# EAGLE design WhiteCane (EAGLE 7.4.0)
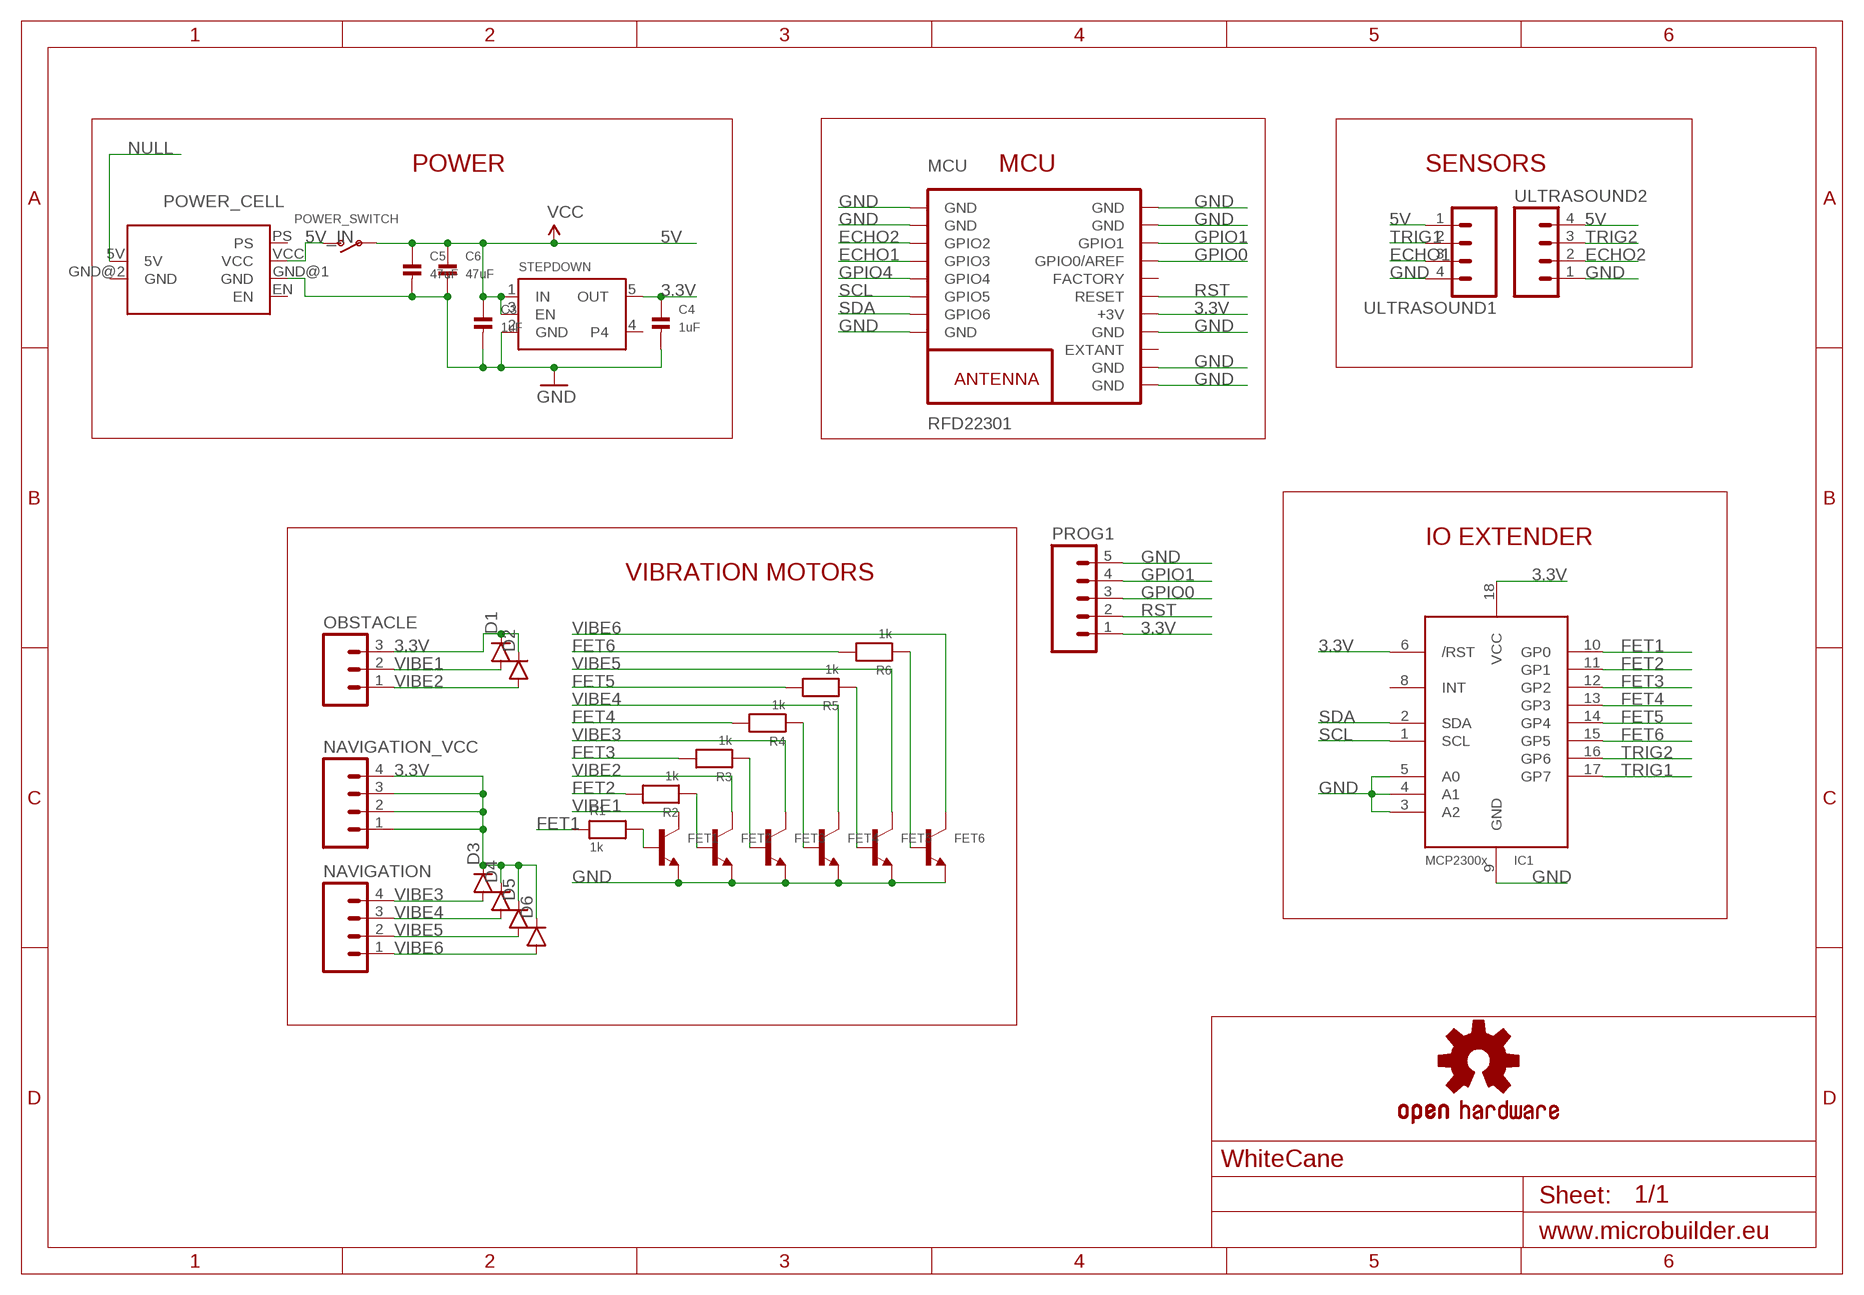
[diagram p0: schematic, sheet 1]

## Parts
C3  1uF  CAP_CERAMIC0603  [0603]
C4  1uF  CAP_CERAMIC0603  [0603]
C5  47uF  CAP_CERAMIC0805  [0805]
C6  47uF  CAP_CERAMIC0805  [0805]
D1  DIODESOD123  [SOD-123]
D2  DIODESOD123  [SOD-123]
D3  DIODESOD123  [SOD-123]
D4  DIODESOD123  [SOD-123]
D5  DIODESOD123  [SOD-123]
D6  DIODESOD123  [SOD-123]
FET1  TRANSISTOR_NPN  [SOT23-R]
FET2  TRANSISTOR_NPN  [SOT23-R]
FET3  TRANSISTOR_NPN  [SOT23-R]
FET4  TRANSISTOR_NPN  [SOT23-R]
FET5  TRANSISTOR_NPN  [SOT23-R]
FET6  TRANSISTOR_NPN  [SOT23-R]
IC1  MCP23008/SO  [SO18W]
LOGO1  OSHW-LOGOL-COPPER  [OSHW-LOGO-L_COPPER]
MCU  RFD22301  [RFD22301]
NAVIGATION  M04PTH  [1X04]
NAVIGATION_VCC  M04PTH  [1X04]
OBSTACLE  M03PTH  [1X03]
POWER_CELL  POWER_CELL  [POWER_CELL]
POWER_SWITCH  SWITCH_SPST  [SPST_SMT_19192]
PROG1  M05PTH  [1X05]
R1  1k  RESISTOR0603  [0603]
R2  1k  RESISTOR0603  [0603]
R3  1k  RESISTOR0603  [0603]
R4  1k  RESISTOR0603  [0603]
R5  1k  RESISTOR0603  [0603]
R6  1k  RESISTOR0603  [0603]
STEPDOWN  VREG_SOT23-5  [SOT23-5]
ULTRASOUND1  M04PTH  [1X04]
ULTRASOUND2  M04PTH  [1X04]

## Nets
3.3V: C4.1 D1.C D2.C D3.C D4.C D5.C D6.C IC1.6(/RST) IC1.18(VCC) MCU.13(+3V) NAVIGATION_VCC.1 NAVIGATION_VCC.2 NAVIGATION_VCC.3 NAVIGATION_VCC.4 OBSTACLE.3 PROG1.1 STEPDOWN.5(OUT)
5V: C3.1 C5.1 C6.1 POWER_SWITCH.B(P) STEPDOWN.1(IN) STEPDOWN.3(EN) ULTRASOUND1.1 ULTRASOUND2.4 ; supply symbol labelled VCC
5V_IN: POWER_CELL.VCC POWER_SWITCH.C(S)
ECHO1: MCU.4(GPIO3) ULTRASOUND1.3
ECHO2: MCU.3(GPIO2) ULTRASOUND2.2
FET1: IC1.10(GP0) R1.1
FET2: IC1.11(GP1) R2.2
FET3: IC1.12(GP2) R3.2
FET4: IC1.13(GP3) R4.2
FET5: IC1.14(GP4) R5.2
FET6: IC1.15(GP5) R6.2
GND: C3.2 C4.2 C5.2 C6.2 FET1.2(E) FET2.2(E) FET3.2(E) FET4.2(E) FET5.2(E) FET6.2(E) IC1.3(A2) IC1.4(A1) IC1.5(A0) IC1.9(GND) MCU.1(GND) MCU.2(GND) MCU.8(GND) MCU.9(GND) MCU.10(GND) MCU.12(GND) MCU.18(GND) MCU.19(GND) POWER_CELL.GND@1(GND) PROG1.5 STEPDOWN.2(GND) ULTRASOUND1.4 ULTRASOUND2.1
GPIO0: MCU.16(GPIO0/AREF) PROG1.3
GPIO1: MCU.17(GPIO1) PROG1.4
GPIO4: MCU.5(GPIO4)
N$1: FET1.1(B) R1.2
N$2: FET2.1(B) R2.1
N$3: FET3.1(B) R3.1
N$4: FET4.1(B) R4.1
N$5: FET5.1(B) R5.1
N$6: FET6.1(B) R6.1
NULL: POWER_CELL.5V
RST: MCU.14(RESET) PROG1.2
SCL: IC1.1(SCL) MCU.6(GPIO5)
SDA: IC1.2(SDA) MCU.7(GPIO6)
TRIG1: IC1.17(GP7) ULTRASOUND1.2
TRIG2: IC1.16(GP6) ULTRASOUND2.3
VIBE1: D1.A FET1.3(C) OBSTACLE.2
VIBE2: D2.A FET2.3(C) OBSTACLE.1
VIBE3: D3.A FET3.3(C) NAVIGATION.4
VIBE4: D4.A FET4.3(C) NAVIGATION.3
VIBE5: D5.A FET5.3(C) NAVIGATION.2
VIBE6: D6.A FET6.3(C) NAVIGATION.1
Unconnected: IC1.8(INT) MCU.11(EXTANT) MCU.15(FACTORY) POWER_CELL.EN POWER_CELL.PS STEPDOWN.4

## Notes on the sheet
- POWER | MCU | SENSORS
- IO EXTENDER
- VIBRATION MOTORS

## Power pins joined to a net without a drawn wire
GND: POWER_CELL.GND@2(GND)

## Library data of the parts
C3-C6 = microbuilder:CAP_CERAMIC: Ceramic Capacitors 0402 - 0402 Surface Mount Capacitors 16pF 50V 5% [Digikey: 445-4899-2-ND] 18pF 50V 5% [Digikey: 490-1281-2-ND] 22pF 50V 5% [Digikey: 490-1283-2-ND] 68pF 50V 5% [Digikey: 490-1289-2-ND] 0.1uF 10V 10% [Digikey: 490-1318-2-ND] 1.0uF 6.3V 10% [Digikey: 490-1320-2-ND] 0603 - 0603 Surface Mount Capacitors 16 pF 50V 5% [Digikey: 445-5051-2-ND] 22 pF 50V [Digikey: PCC220ACVTR-ND] 33 pF 50V 5% [Digikey: 490-1415-1-ND] 56pF 50V 5% [Digikey: 490-1421-1-ND] 220pF 50V 5% [Digikey: 445-1285-1-ND] 680 pF 50V 2200 pF 50V 5% C0G [Digikey: 445-1297-1-ND] 5600 pF 100V 5% X7R [Digikey: 478-3711-1-ND] 0.1 µF 25V 10% [Digikey: PCC2277TR-ND] 0.22 µF 16V 10% X7R [Digikey: 445-1318-1-ND] 1.0 µF 25V 10% [Digikey: 445-5146-2-ND] 0603 - RF Specific 3pF 250V +/-0.1pF RF [Digikey: 712-1347-1-ND] 18 pF 250V 5% [Digikey: 478-3505-1-ND or 712-1322-1-ND] 56 pF 250V 5% C0G RF [Digikey: 490-4867-1-ND] 68 pF 250V RF [Digikey: 490-4868-1-ND] 0805 - 0805 Surface Mount Capacitors 220 pF 250V 2% RF Ceramic Capacitor [Digikey: 712-1398-1-ND] 1000 pF 50V 2% NP0 Ceramic Capacitor [Digikey: 478-3760-1-ND] 0.1 µF 25V 10% Ceramic Capacitor [Digikey: PCC1828TR-ND] 1.0 µF 16V 10% Ceramic Capacitor[Digikey: 490-1691-2-ND] 10.0 µF 10V 10% Ceramic Capacitor[Digikey: 709-1228-1-ND] 10.0 uF 16V 10% Ceramic Capacitor [Digikey: 478-5165-2-ND] 47 uF 6.3V 20% Ceramic Capacitor [Digikey: 587-1779-1-ND or 399-5506-1-ND] 1206 - 1206 Surface Mount Capacitors 47uF 10V 20% Ceramic Capacitor [Digikey: 490-5528-1-ND or 399-5508-1-ND or 445-6010-1-ND] 100uF 6.3V -20%, +80% Y5V Ceramic Capacitor (Digikey: 490-4512-1-ND, Mouser: 81-GRM31CF50J107ZE1L)
D1-D6 = SparkFun-DiscreteSemi:DIODE: Diode These are standard reverse protection diodes and small signal diodes. SMA package can handle up to about 1A. SOD-323 can handle about 200mA. What the SOD-323 package when ordering, there are some mfgs out there that are 5-pin packages.
FET1-FET6 = microbuilder:TRANSISTOR_NPN: NPN Transistor Transistor (NPN) 500mA 45V - BC817 [Digikey: 568-1631-1-ND] Transistor (NPN) 500mA 45V - BC817,215 [Mouser: 771-BC817-T/R] SOT23-R - SOT23 footprint optimised for use with solder paste and reflow ovens. SOT23-W - SOT23 footprint optimised for hand-soldering (larger pads).
IC1 = adafruit:MCP23008: MCP23008 Inexpensive i2c i/o expander - 8 general purpose i/o pins with optional pullups
LOGO1 = SparkFun-Aesthetics:OSHW-LOGO: Open Source Hardware Logo This logo indicates the piece of hardware it is found on incorporates a OSHW license and/or adheres to the definition of open source hardware found here: http://freedomdefined.org/OSHW
MCU = RF_Digital_RFD22301_Eagle_Schematic_PCB_Library:RFD22301: RFD22301 RFduino SMT Module RFD22301 Datasheet: http://www.rfdigital.com/wp-content/uploads/2014/03/RFD22301.Data_.Sheet_.11.24.13_11.38PM.pdf
NAVIGATION NAVIGATION_VCC ULTRASOUND1 ULTRASOUND2 = SparkFun-Connectors:M04: Header 4 Standard 4-pin 0.1" header. Use with straight break away headers (SKU : PRT-00116), right angle break away headers (PRT-00553), swiss pins (PRT-00743), machine pins (PRT-00117), and female headers (PRT-00115). Molex polarized connector foot print use with SKU : PRT-08231 with associated crimp pins and housings. 1MM SMD Version SKU: PRT-10208
OBSTACLE = SparkFun-Connectors:M03: Header 3 Standard 3-pin 0.1" header. Use with straight break away headers (SKU : PRT-00116), right angle break away headers (PRT-00553), swiss pins (PRT-00743), machine pins (PRT-00117), and female headers (PRT-00115). Molex polarized connector foot print use with SKU : PRT-08232 with associated crimp pins and housings.
POWER_CELL = myParts:POWER_CELL
POWER_SWITCH = microbuilder:SWITCH_SPST: Switch - SPST 4UCon 19192 (6.7x2.6mm SMT)
PROG1 = SparkFun-Connectors:M05: Header 5 Standard 5-pin 0.1" header. Use with straight break away headers (SKU : PRT-00116), right angle break away headers (PRT-00553), swiss pins (PRT-00743), machine pins (PRT-00117), and female headers (PRT-00115). Molex polarized connector foot print use with SKU : PRT-08230 with associated crimp pins and housings.
R1-R6 = microbuilder:RESISTOR: Resistors 0402 - 0402 Surface Mount Package 22 Ohm 1% 1/16W [Digikey: 311-22.0LRTR-ND] 33 Ohm 5% 1/16W 1.0K 5% 1/16W 1.5K 5% 1/16W 2.0K 1% 1/16W 10.0K 1% 1/16W [Digikey: 311-10.0KLRTR-ND] 10.0K 5% 1/16W [Digikey: RMCF0402JT10K0TR-ND] 12.1K 1% 1/16W [Digikey: 311-22.0LRTR-ND] 100.0K 5% 1/16W 0603 - 0603 Surface Mount Package 0 Ohm 1/10 Watt 1% Resistor 15 Ohm 1/10 Watt 1% Resistor 33 Ohm 1/10 Watt 1% Resistor 49.9 Ohm 1/10 Watt 1% Resistor 100 Ohm 1/10 Watt 1% Resistor 150 Ohm 1/10 Watt 1% Resistor 240 Ohm 1/10 Watt 1% Resistor 390 Ohm 1/10 Watt 1% Resistor 560 Ohm 1/10 Watt 1% Resistor 680 Ohm 1/10 Watt 1% Resistor 750 Ohm 1/10 Watt 1% Resistor 1.0K Ohm 1/10 Watt 1% Resistor 1.5K Ohm 1/10 Watt 1% Resistor 2.0K Ohm 1/10 Watt 1% Resistor 2.2K Ohm 1/10 Watt 1% Resistor 3.3K Ohm 1/10 Watt 1% Resistor 4.7K Ohm 1/10 Watt 1% Resistor 10.0K Ohm 1/10 Watt 1% Resistor 12.0K Ohm 1/10 Watt 1% Resistor 12.1K Ohm 1/10 Watt 1% Resistor 20.0K Ohm 1/10 Watt 1% Resistor 33.0K Ohm 1/10 Watt 1% Resistor 100.0K Ohm 1/10 Watt 1% Resistor 0805 - 0805 Surface Mount Package 0 Ohm 1/8 Watt 1% Resistor 33 Ohm 1/8 Watt 1% Resistor 100 Ohm 1/8 Watt 1% Resistor 150 Ohm 1/8 Watt 1% Resistor 200 Ohm 1/8 Watt 1% Resistor 240 Ohm 1/8 Watt 1% Resistor 330 Ohm 1/8 Watt 1% Resistor 390 Ohm 1/8 Watt 1% Resistor 470 Ohm 1/8 Watt 1% Resistor 1.0K Ohm 1/8 Watt 1% Resistor 1.5K Ohm 1/8 Watt 1% Resistor 2.0K Ohm 1/8 Watt 1% Resistor 4.7K Ohm 1/8 Watt 1% Resistor 5.1K Ohm 1/8 Watt 1% Resistor 5.6K Ohm 1/8 Watt 1% Resistor 10.0K Ohm 1/8 Watt 1% Resistor 22.0K Ohm 1/8 Watt 1% Resistor 33.0K Ohm 1/8 Watt 1% Resistor 100K Ohm 1/8 Watt 1% Resistor 1206 - 1206 Surface Mount Package 2012 - 2010 Surface Mount Package 0.11 Ohm 1/2 Watt 1% Resistor - Digikey: RHM.11UCT-ND
STEPDOWN = microbuilder:VREG_SOT23-5: SOT23-5 Fixed Voltage Regulators To better organise some of the SOT23-5 fixed voltage regulators in this library, this new part was created. Part Current Out V Out V In V Dropout Digikey Part No. ADP121 150mA 3.3V 3.4-5.5V 0.09V @ 150mA ADP121-AUJZ33R7CT-ND ADP121 150mA 3.0V 3.1-5.5V 0.09V @ 150mA ADP121-AUJZ30R7CT-ND ADP122 300mA 3.3V 3.4-5.5V 0.085V @ 300mA ADP122AUJZ-3.3-R7CT-ND ADP1712 300mA 3.3V 3.5-5.5V 0.17V @ 300mA ADP1712AUJZ-3.3-R7TR-ND AP7311 (Low Cost) 150mA 3.3V 3.5-6V 0.15V @ 150mA AP7311-33WG-7DICT-ND LD39015M18R 150mA 1.8V 1.9V-5.5V 0.08V @ 100mA 497-6977-1-ND MCP1824T-3302E/OT 300mA 3.3V 3.5V-6V 0.2V @ 300mA MCP1824T-3302E/OTCT-ND MIC5205-2.5YM5 TR 150mA 2.5V 2.7-16V 0.165V @ 150mA 576-1257-2-ND MIC5205-3.0YM5 TR 150mA 3.0V 3.2V-16V 0.165V @ 150mA 576-1258-2-ND MIC5205-3.3YM5 TR 150mA 3.3V 3.5V-16V 0.165V @ 150mA 576-1259-2-ND TPS780330220 150mA 3.3V+2.2V 3.6-5.5V 250mV Max 296-23332-1-ND TDA3663/N1,135 100mA 3.3V 3.5-45V 0.18V @ 50mA 568-5343-1-ND

## Board
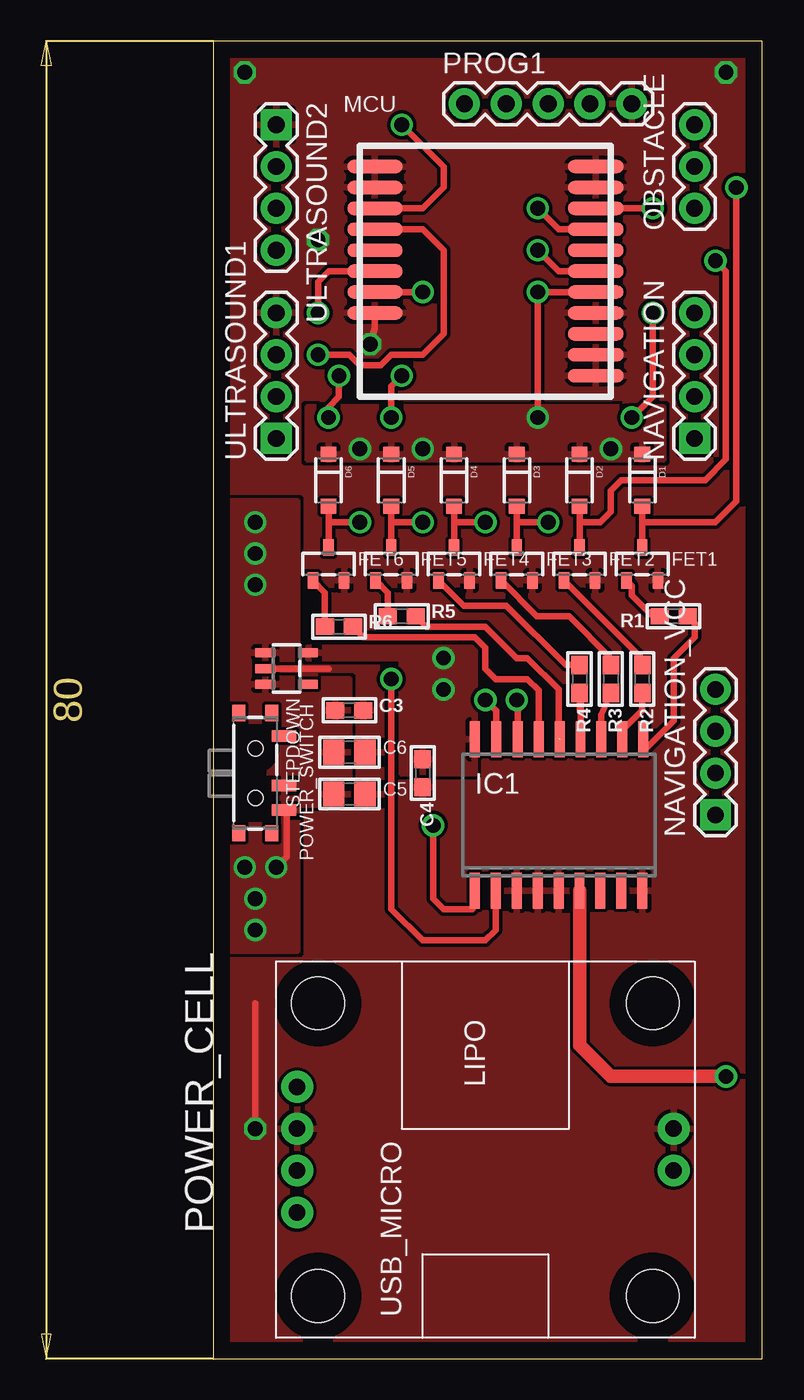
[diagram p1: board, top side]
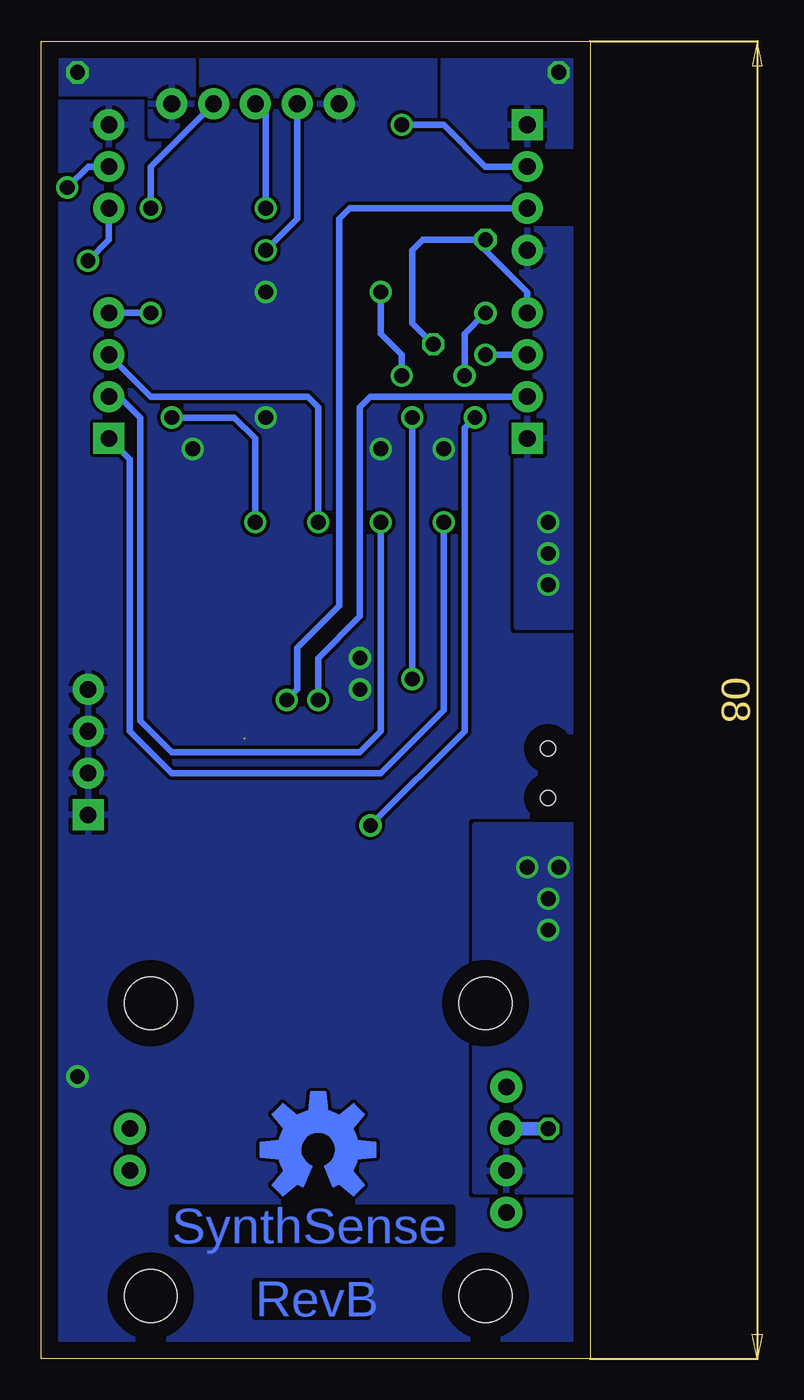
[diagram p2: board, bottom side, seen from below]

Size 33.33 x 80 mm. Coordinates in mm from the lower left corner, seen from the top.
Outline: 0,0 33.33,0 33.33,80 0,80 0,0
Copper layers (1*16): Top 0.035mm / dielectric 1.5mm / Bottom 0.035mm
Design rules "default": minimum track width 10mil, minimum drill 24mil, track to track 8mil, track to pad 8mil, pad to pad 8mil, via to via 8mil, smd to smd 8mil, copper to edge 40mil, drill to drill 8mil, minimum pad ring 10mil, minimum via ring 8mil, stop-mask expansion 4mil, vias tented up to drill 0mil, thermal gap 10mil

### Footprints (pad centres in the part's own frame; a part is rotated, then mirrored left to right if it is on the bottom)
0603 = smd 1.1 x 1: 1 -0.85,0; 2 0.85,0
0805 = smd 1.3 x 1.5: 1 -0.95,0; 2 0.95,0
SOD-123 = smd 0.9 x 0.95: A 1.575,0; C -1.575,0
SOT23-R = smd 0.635 x 1.016: 1 -0.95,-1; 2 0.95,-1; 3 0,1
SO18W = smd 0.6 x 2.2: 1 -4.445,-4.6; 2 -3.175,-4.6; 3 -1.905,-4.6; 4 -0.635,-4.6; 5 0.635,-4.6; 6 1.905,-4.6; 7 3.175,-4.6; 8 4.445,-4.6; 9 5.715,-4.6; 10 5.775,4.6; 11 4.505,4.6; 12 3.235,4.6; 13 1.965,4.6; 14 0.695,4.6; 15 -0.575,4.6; 16 -1.845,4.6; 17 -3.145,4.6; 18 -4.445,4.6
RFD22301 = smd 3.353 x 0.813: 1 -6.706,7.62; 2 -6.706,6.35; 3 -6.706,5.08; 4 -6.706,3.81; 5 -6.706,2.54; 6 -6.706,1.27; 7 -6.706,0; 8 -6.706,-1.27; 9 6.706,-5.08; 10 6.706,-3.81; 11 6.706,-2.54; 12 6.706,-1.27; 13 6.706,0; 14 6.706,1.27; 15 6.706,2.54; 16 6.706,3.81; 17 6.706,5.08; 18 6.706,6.35; 19 6.706,7.62
1X04 = drill 1.016 pad 1.88 square: 1 0,0 | drill 1.016 pad 1.88: 2 2.54,0; 3 5.08,0; 4 7.62,0
1X03 = drill 1.016 pad 1.88: 1 0,0; 2 2.54,0; 3 5.08,0
POWER_CELL = drill 1 pad 1.93: 5V -1.27,-11.43; EN 3.81,11.43; GND@1 1.27,11.43; GND@2 1.27,-11.43; PS -3.81,11.43; VCC -1.27,11.43 | hole 3.2: -8.89,10.16; 8.89,10.16; 8.89,-10.16; -8.89,-10.16
SPST_SMT_19192 = smd 0.7 x 1.5: A -2.25,1.75; B 0.75,1.75; C 2.25,1.75 | smd 1 x 0.8: GND1 -3.65,1; GND2 -3.65,-1; GND3 3.65,1; GND4 3.65,-1 | hole 0.9: -1.5,0; 1.5,0
1X05 = drill 1.016 pad 1.88: 1 0,0; 2 2.54,0; 3 5.08,0; 4 7.62,0; 5 10.16,0
SOT23-5 = smd 0.55 x 1.2: 1 -0.95,-1.3; 2 0,-1.3; 3 0.95,-1.3; 4 0.95,1.3; 5 -0.95,1.3

### Placement (x,y rotation side)
C3  8.25,39.37 0 top
C4  12.7,35.56 270 top
C5  8.25,34.29 0 top
C6  8.25,36.83 0 top
D1  26.04,53.34 270 top
D2  22.22,53.34 270 top
D3  18.41,53.34 270 top
D4  14.61,53.34 270 top
D5  10.79,53.34 270 top
D6  6.99,53.34 270 top
FET1  26.04,48.26 0 top
FET2  22.22,48.26 0 top
FET3  18.41,48.26 0 top
FET4  14.61,48.26 0 top
FET5  10.79,48.26 0 top
FET6  6.99,48.26 0 top
IC1  20.32,33.02 0 top
LOGO1  16.51,12.7 0 top
MCU  16.51,64.77 0 top
NAVIGATION  29.21,55.88 90 top
NAVIGATION_VCC  30.48,33.02 90 top
OBSTACLE  29.21,69.85 90 top
POWER_CELL  16.51,12.7 90 top
POWER_SWITCH  2.54,35.56 270 top
PROG1  15.24,76.2 0 top
R1  27.94,45.09 180 top
R2  26.04,41.27 270 top
R3  24.13,41.27 270 top
R4  22.22,41.27 270 top
R5  11.43,45.09 0 top
R6  7.62,44.45 0 top
STEPDOWN  4.44,41.91 270 top
ULTRASOUND1  3.81,55.88 90 top
ULTRASOUND2  3.81,74.93 270 top

### Tracks (layer width: path | path; a pad name or v marks a point on that pad's centre or on a via)
3.3V  (via drill 0.9)
  Top 0.406: MCU.13 v19.68,64.77 v19.68,57.15
  Top 0.813: IC1.6 22.22,19.05 24.13,17.15 v31.11,17.15
  other vias: 8.89,55.24 12.7,55.24 24.13,55.24 13.97,42.55 13.97,40.64
  pour Bottom (rank 2): -7.62,85.09 41.91,85.09 41.91,-6.35 -7.62,-6.35
  pour Top: 5.72,57.15 5.72,54.61 27.3,54.61 27.3,57.79 5.72,57.79
  pour Top: 5.72,43.18 5.72,42.55 11.43,42.55 11.43,35.56 15.88,35.56 15.88,43.18
5V  (via drill 0.9)
  other vias: 2.54,46.99 2.54,48.9 2.54,50.8
  pour Top: 5.08,40.64 -1.27,40.64 -1.27,52.07 5.08,52.07
  pour Top: -3.81,33.66 8.25,33.66 8.25,41.27 -3.81,41.27
  pour Bottom: 4.44,44.45 -2.54,44.45 -2.54,68.58 4.44,68.58
5V_IN  (via drill 0.9)
  Top 0.406: POWER_SWITCH.C 4.44,33.16 4.44,30.48 v3.81,29.84
  other vias: 2.54,26.04 2.54,27.94 1.91,29.84
  pour Bottom: 6.99,10.16 0,10.16 0,32.39 6.99,32.39
  pour Top: 5.08,24.77 0,24.77 0,33.66 5.08,33.66
ECHO1  (via drill 0.9)
  Top 0.406: MCU.4 12.7,68.58 13.97,67.31 13.97,62.23 12.7,60.96 10.79,60.96 10.16,60.33 8.89,60.33 8.25,60.96 v6.35,60.96
  Bottom 0.406: ULTRASOUND1.3 v6.35,60.96
ECHO2  (via drill 0.9)
  Top 0.406: v11.43,74.93 13.97,72.39 13.97,71.12 12.7,69.85 MCU.3
  Bottom 0.406: ULTRASOUND2.2 6.35,72.39 8.89,74.93 v11.43,74.93
FET1
  Top 0.406: IC1.10 26.19,36.98 27.94,38.73 27.94,42.55 29.21,43.81 29.21,44.66 R1.1
FET2
  Top 0.406: IC1.11 24.82,38.16 26.04,39.37 R2.2
FET3
  Top 0.406: IC1.12 23.55,39.09 R3.2
FET4
  Top 0.406: 22.22,39.37 R4.2 22.29,39.73 IC1.13
FET5  (1 unrouted)
  Top 0.406: IC1.14 21.02,37.41 | R5.2 12.91,44.45 16.51,44.45 18.41,42.55 19.05,42.55 20.95,40.64 20.95,37.68
FET6
  Top 0.406: R6.2 9.11,43.81 15.88,43.81 16.51,43.18 16.51,41.91 17.14,41.27 19.05,41.27 19.74,40.58 IC1.15
GND  (via drill 0.9)
  Top 0.406: STEPDOWN.2 6.99,41.91 | v2.54,13.97 2.54,21.59 | MCU.8 9.8,62.59 v9.52,61.59
  Bottom 0.406: v9.52,61.59 10.79,62.87 10.79,67.31 10.16,67.94 v6.35,67.94 6.35,67.31 3.81,64.77 ULTRASOUND1.4
  Bottom 0.813: POWER_CELL.GND@1 v2.54,13.97
  other vias: 31.11,78.11 1.91,78.11
  pour Top (rank 2): -2.54,81.28 35.56,81.28 35.56,-2.54 -2.54,-2.54
  pour Bottom: 24.13,79.38 24.13,74.3 26.67,74.3 26.67,76.83 32.39,76.83 32.39,79.38
  pour Bottom: -2.54,86.36 8.89,86.36 8.89,73.66 -2.54,73.66
GPIO0  (via drill 0.9)
  Top 0.406: MCU.16 20.95,68.58 v19.68,69.85
  Bottom 0.406: v19.68,69.85 19.68,75.56 PROG1.3
GPIO1  (via drill 0.9)
  Top 0.406: MCU.17 v26.67,69.85
  Bottom 0.406: PROG1.4 26.67,72.39 v26.67,69.85
N$1
  Top 0.406: R1.2 26.67,45.09 25.4,46.36 25.4,46.95 FET1.1
N$2
  Top 0.406: R2.1 26.04,42.5 FET2.1
N$3
  Top 0.406: R3.1 24.13,42.55 21.59,45.09 19.64,45.09 FET3.1
N$4
  Top 0.406: FET4.1 15.2,45.72 17.78,45.72 21.38,42.12 R4.1
N$5
  Top 0.406: R5.1 10.58,46.52 FET5.1
N$6
  Top 0.406: R6.1 6.77,46.52 FET6.1
RST  (via drill 0.9)
  Top 0.406: MCU.14 20.95,66.04 v19.68,67.31
  Bottom 0.406: v19.68,67.31 17.78,69.22 PROG1.2
SCL  (via drill 0.9)
  Top 0.406: v6.35,63.5 6.35,65.41 6.99,66.04 MCU.6 | v6.99,57.15 6.99,57.79 7.62,58.42 v7.62,59.69 | v13.33,32.39 13.33,27.94 13.97,27.3 15.72,27.3 IC1.1
  Bottom 0.406: v13.33,32.39 7.62,38.1 7.62,56.52 v6.99,57.15 | v7.62,59.69 7.62,62.23 v6.35,63.5
SDA  (via drill 0.9)
  Top 0.406: v10.79,41.27 10.79,27.3 12.7,25.4 16.51,25.4 17.14,26.04 IC1.2 | v12.7,64.77 MCU.7 | v10.79,57.15 10.79,59.05 v11.43,59.69
  Bottom 0.406: v10.79,41.27 v10.79,57.15 | v11.43,59.69 11.43,60.96 12.7,62.23 v12.7,64.77
TRIG1  (via drill 0.9)
  Top 0.406: IC1.17 17.18,39.34 v16.51,40
  Bottom 0.406: ULTRASOUND1.2 13.33,58.42 13.97,57.79 13.97,45.09 16.51,42.55 v16.51,40
TRIG2  (via drill 0.9)
  Top 0.406: IC1.16 18.47,39.31 v18.41,40
  Bottom 0.406: ULTRASOUND2.3 14.61,69.85 15.24,69.22 15.24,45.72 17.78,43.18 17.78,40.64 v18.41,40
VIBE1  (via drill 0.9)
  Top 0.406: FET1.3 D1.A 26.04,50.8 30.48,50.8 31.75,52.07 v31.75,71.12
  Bottom 0.406: v31.75,71.12 30.48,72.39 OBSTACLE.2
VIBE2  (via drill 0.9)
  Top 0.406: 22.22,50.8 FET2.3 | D2.A 22.22,50.8 | v30.48,66.67 31.11,66.04 31.11,54.61 29.85,53.34 24.76,53.34 24.13,52.7 24.13,51.44 23.49,50.8 22.22,50.8
  Bottom 0.406: v30.48,66.67 29.21,67.94 OBSTACLE.1
VIBE3  (via drill 0.9)
  Top 0.406: FET3.3 D3.A 18.41,50.8 v20.32,50.8 | v25.4,57.15 26.67,58.42 v26.67,63.5
  Bottom 0.406: v20.32,50.8 20.32,55.88 21.59,57.15 v25.4,57.15 | v26.67,63.5 NAVIGATION.4
VIBE4  (via drill 0.9)
  Top 0.406: FET4.3 D4.A 14.61,50.8 v16.51,50.8
  Bottom 0.406: v16.51,50.8 16.51,57.79 17.14,58.42 26.67,58.42 NAVIGATION.3
VIBE5  (via drill 0.9)
  Top 0.406: FET5.3 D5.A 10.79,50.8 v12.7,50.8
  Bottom 0.406: v12.7,50.8 12.7,38.1 13.97,36.83 25.4,36.83 27.3,38.73 27.3,57.15 28.57,58.42 NAVIGATION.2
VIBE6  (via drill 0.9)
  Top 0.406: FET6.3 D6.A 6.99,50.8 v8.89,50.8
  Bottom 0.406: v8.89,50.8 8.89,39.37 12.7,35.56 25.4,35.56 27.94,38.1 27.94,54.61 NAVIGATION.1

### Text on the board
Bottom: SynthSense | RevB
Document: 3.3V (NO!) | RST | GPIO0 | GPIO1 | GND | GND | 3.3V | ECHO2 | VIBE1 | TRIG2 | VIBE2 | 5V | GND | VIBE3 | ECHO1 | VIBE4 | TRIG1 | VIBE5 | 5V | VIBE6 | 3.3V | 3.3V | 3.3V | 3.3V